# EAGLE design hv (EAGLE 5.06)
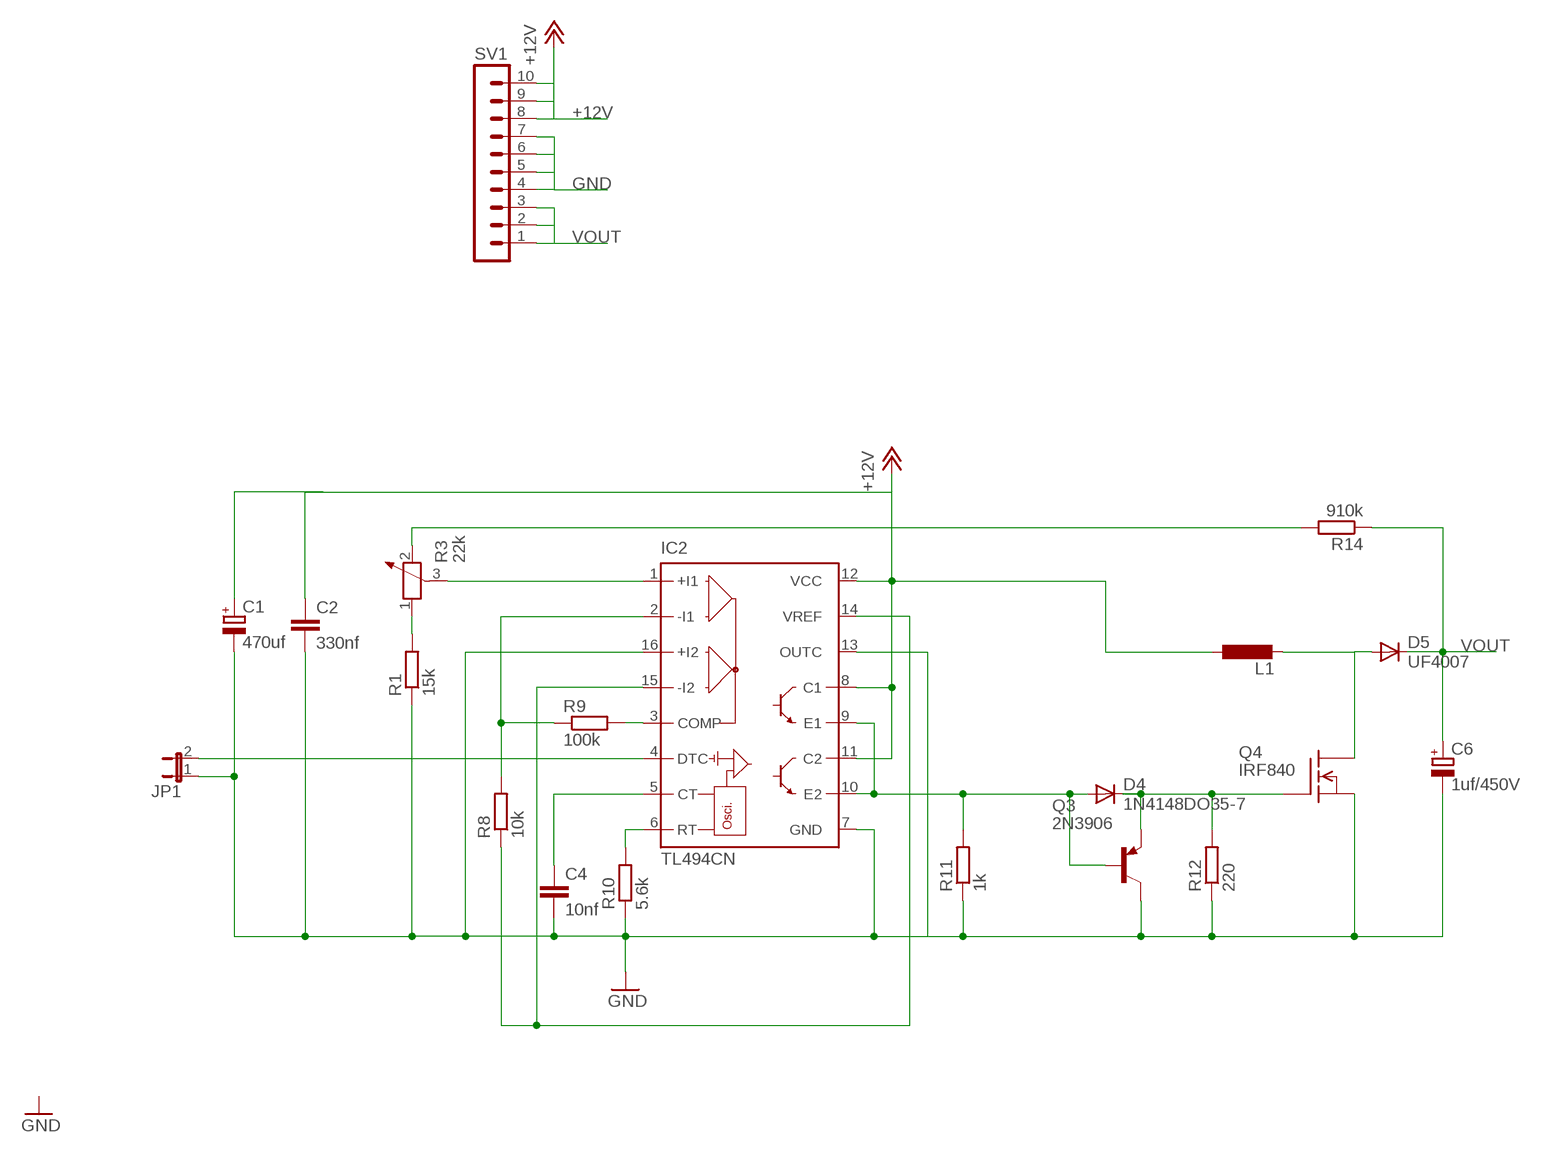
[diagram p0: schematic, sheet 1]

## Parts
C1  470uf  CPOL-EUSANYO_E13  [SANYO-OSCON_E13]
C2  330nf  C-EU025_050-025X075  [C025_050-025X075]
C4  10nf  C-EU025_050-025X075  [C025_050-025X075]
C6  1uf/450V  CPOL-EUSANYO_E13  [SANYO-OSCON_E13]
D4  1N4148DO35-7  [DO35-7]
D5  UF4007  UF4003  [DO41-10]
IC2  TL494CN  [DIL16]
JP1  JP1E  [JP1]
L1  L-EUIR-4  [IR-4]
Q3  2N3906  [TO92]
Q4  IRF840  [TO220]
R1  15k  R-EU_0204/7  [0204/7]
R3  22k  POTENTIOMETER_PT-10  [PT-10]
R8  10k  R-EU_0204/7  [0204/7]
R9  100k  R-EU_0204/7  [0204/7]
R10  5.6k  R-EU_0204/7  [0204/7]
R11  1k  R-EU_0204/7  [0204/7]
R12  220  R-EU_0204/7  [0204/7]
R14  910k  R-EU_0204/7  [0204/7]
SV1  MA10-1W  [MA10-1W]

## Nets
+12V: C1.+ C2.1 IC2.8(C1) IC2.11(C2) IC2.12(VCC) L1.1 SV1.8 SV1.9 SV1.10
GND: C1.- C2.2 C4.2 C6.- IC2.7(GND) IC2.13(OUTC) IC2.16(+I2) JP1.1 Q3.1(C) Q4.3(S) R1.1 R10.1 R11.1 R12.1 SV1.4 SV1.5 SV1.6 SV1.7
N$1: IC2.4(DTC) JP1.2
N$2: D4.C Q3.3(E) Q4.1(G) R12.2
N$3: IC2.3(COMP) R9.2
N$4: IC2.2(-I1) R8.2 R9.1
N$6: IC2.1(+I1) R3.3
N$7: R1.2 R3.1
N$8: D4.A IC2.9(E1) IC2.10(E2) Q3.2(B) R11.2
N$9: IC2.6(RT) R10.2
N$10: C4.1 IC2.5(CT)
N$11: D5.A L1.2 Q4.2(D)
N$13: R3.2 R14.2
VOUT: C6.+ D5.C R14.1 SV1.1 SV1.2 SV1.3
VREF: IC2.14(VREF) IC2.15(-I2) R8.1

## Library data of the parts
C1 C6 = rcl:CPOL-EU: POLARIZED CAPACITOR, European symbol
C2 C4 = rcl:C-EU: CAPACITOR, European symbol
D4 = diode:1N4148: DIODE high speed (Philips)
D5 = diode:UF4003: DIODE ultrafast recovery diode, 200 V rectifier
IC2 = linear:TL494*: SWITCHMODE Pulse Width Modulation Control Circuit NCV494B http://onsemi.com tl494-d.pdf
JP1 = jumper:JP1E: JUMPER
L1 = rcl:L-EU: INDUCTOR, European symbol
Q3 = transistor-pnp:2N3906: PNP Transistor
Q4 = transistor-fet:IRF840: N-Channel Enhancement MOSFET (HEXFET); 500V; 8A; 0,85Ohm
R1 R8-R12 R14 = rcl:R-EU_: RESISTOR, European symbol
R3 = rcl:POTENTIOMETER_: Potentiometer
SV1 = con-lstb:MA10-1W: PIN HEADER

## Board
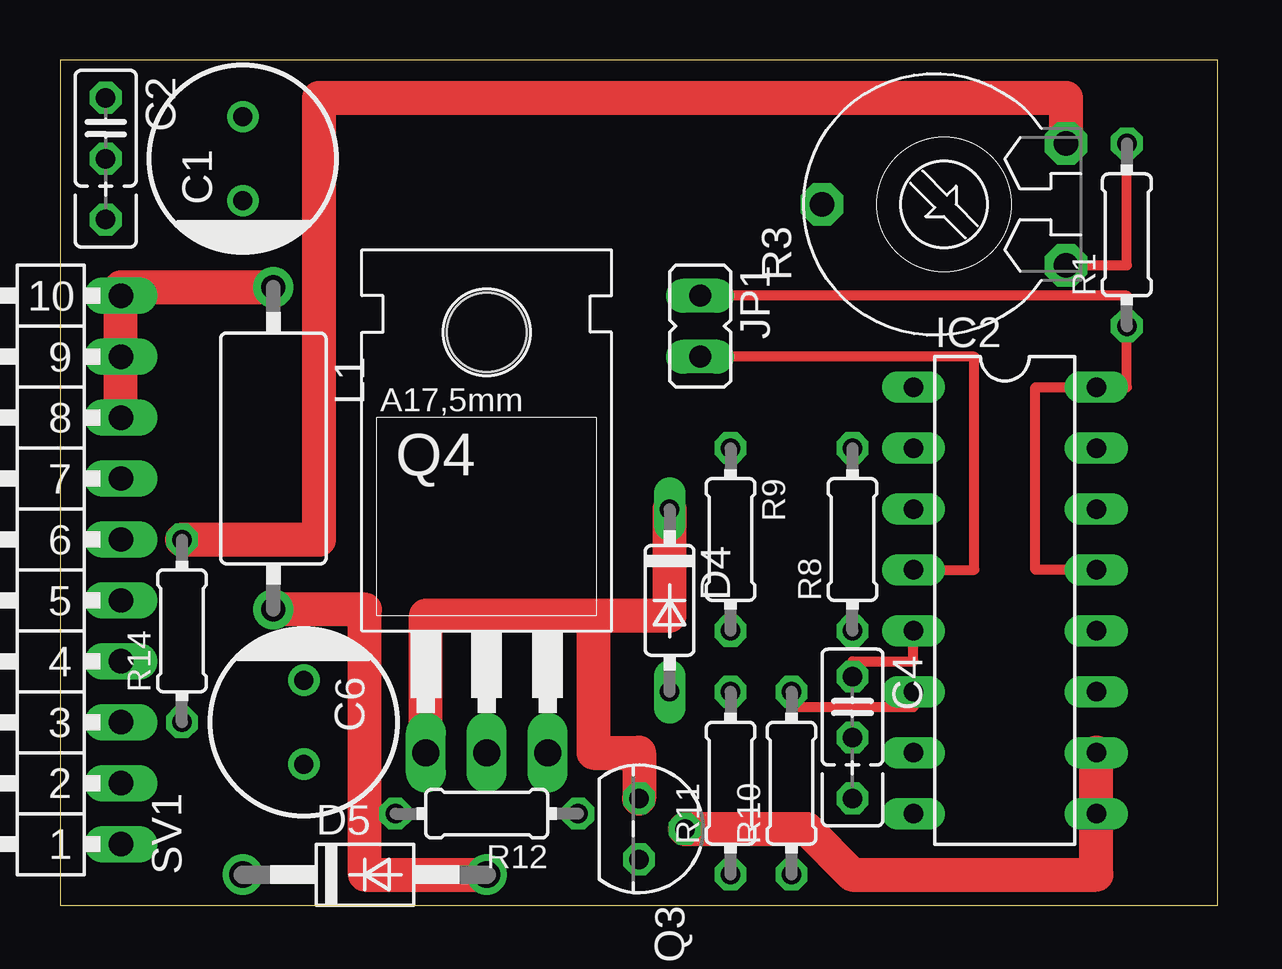
[diagram p1: board, top side]
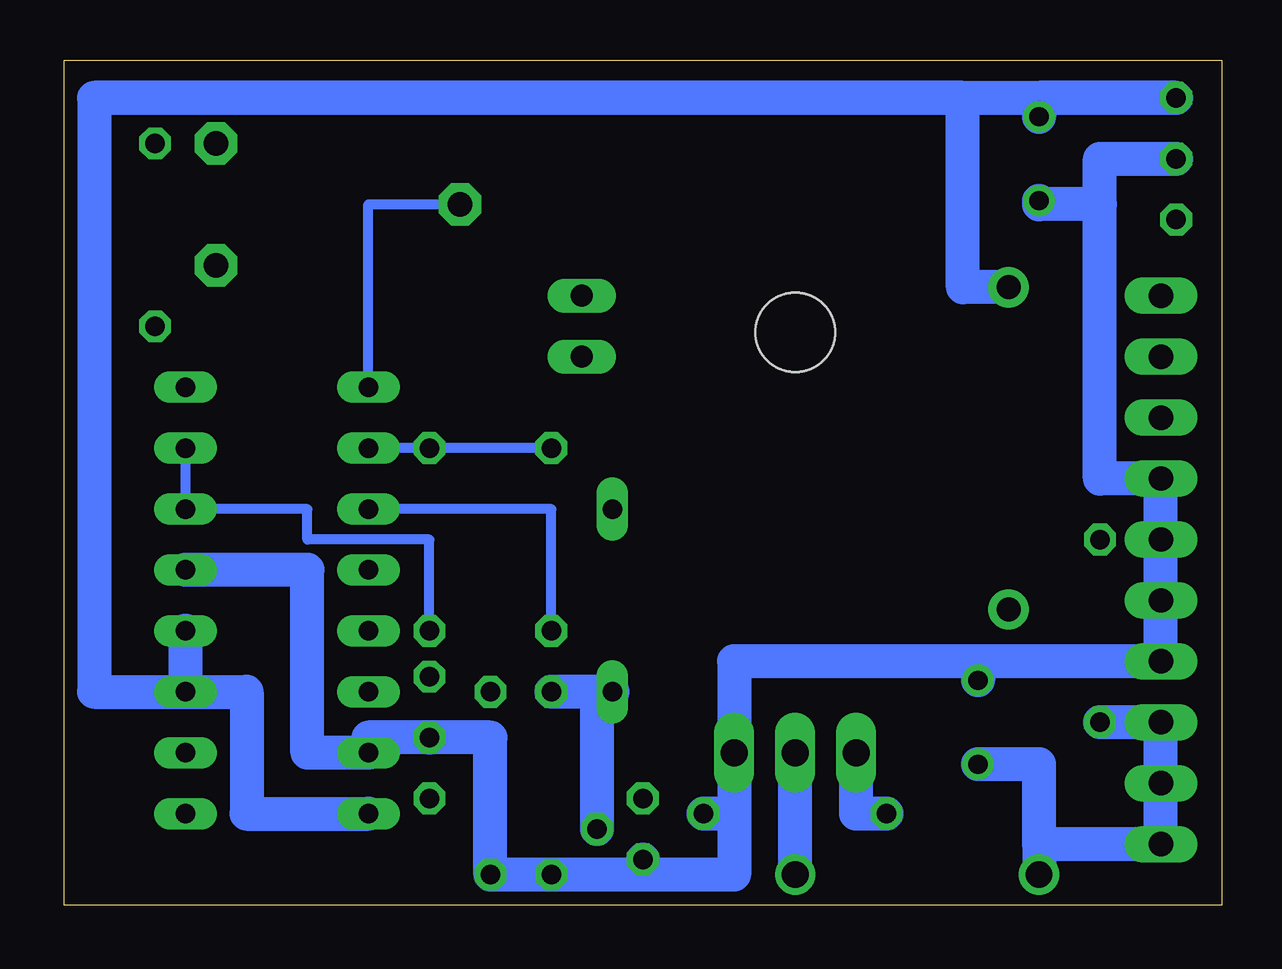
[diagram p2: board, bottom side, seen from below]

Size 48.24 x 35.23 mm. Coordinates in mm from the lower left corner, seen from the top.
Outline: 0,0 48.24,0 48.24,35.23 0,35.23 0,0
Copper layers (1*16): Top 0.035mm / dielectric 1.5mm / Bottom 0.035mm
Design rules "default": minimum track width 10mil, minimum drill 24mil, track to track 8mil, track to pad 8mil, pad to pad 8mil, via to via 8mil, smd to smd 8mil, copper to edge 40mil, drill to drill 8mil, minimum pad ring 10mil, minimum via ring 8mil, stop-mask expansion 4mil, vias tented up to drill 0mil, thermal gap 10mil

### Footprints (pad centres in the part's own frame; a part is rotated, then mirrored left to right if it is on the bottom)
SANYO-OSCON_E13 = drill 0.8 pad 1.27 round: + 1.75,0; - -1.75,0
C025_050-025X075 = drill 0.813 octagon: 1 -1.27,0; 2 1.27,0; 3 3.81,0
DO35-7 = drill 0.813 long: A 3.81,0; C -3.81,0
DO41-10 = drill 1.118 round: A 5.08,0; C -5.08,0
DIL16 = drill 0.813 long: 1 -8.89,-3.81; 2 -6.35,-3.81; 3 -3.81,-3.81; 4 -1.27,-3.81; 5 1.27,-3.81; 6 3.81,-3.81; 7 6.35,-3.81; 8 8.89,-3.81; 9 8.89,3.81; 10 6.35,3.81; 11 3.81,3.81; 12 1.27,3.81; 13 -1.27,3.81; 14 -3.81,3.81; 15 -6.35,3.81; 16 -8.89,3.81
JP1 = drill 0.914 long: 1 0,-1.27; 2 0,1.27
IR-4 = drill 1 pad 1.676 round: 1 -6.705,0; 2 6.73,0
TO92 = drill 0.813 octagon: 1 1.27,0; 2 0,1.905; 3 -1.27,0
TO220 = drill 1.118 long: 1 -2.54,-6.35; 2 0,-6.35; 3 2.54,-6.35 | hole 3.302: 0,11.176
0204/7 = drill 0.813 octagon: 1 -3.81,0; 2 3.81,0
PT-10 = drill 1.016 pad 1.778 octagon: 1 -2.54,-5.08; 2 2.54,-5.08; 3 0,5.08
MA10-1W = drill 1.016 long: 1 -11.43,0; 2 -8.89,0; 3 -6.35,0; 4 -3.81,0; 5 -1.27,0; 6 1.27,0; 7 3.81,0; 8 6.35,0; 9 8.89,0; 10 11.43,0

### Placement (x,y rotation side)
C1  7.62,31.11 90 top
C2  1.91,32.38 270 top
C4  33.02,8.26 270 top
C6  10.16,7.62 270 top
D4  25.4,12.7 270 top
D5  12.7,1.27 0 top
IC2  39.37,12.7 270 top
JP1  26.67,24.13 180 top
L1  8.89,19.05 270 top
Q3  24.13,3.17 270 top
Q4  17.78,12.7 0 top
R1  44.45,27.94 90 top
R3  36.83,29.21 90 top
R8  33.02,15.24 90 top
R9  27.94,15.24 270 top
R10  30.48,5.08 90 top
R11  27.94,5.08 90 top
R12  17.78,3.81 180 top
R14  5.08,11.43 90 top
SV1  2.54,13.97 90 top

### Tracks (layer width: path | path; a pad name or v marks a point on that pad's centre or on a via)
+12V
  Top 1.422: SV1.8 SV1.9 SV1.10 2.54,25.75 L1.1
  Bottom 1.422: IC2.8 40.64,3.81 40.64,8.89 IC2.11 | IC2.11 IC2.12 | 46.99,33.66 46.99,8.89 IC2.11 | C1.+ 7.62,33.66 C2.1 46.99,33.66 | 46.99,33.66 10.79,33.66 10.79,25.75 L1.1
GND
  Top 0.406: JP1.1 44.45,25.4 R1.1 44.45,21.59 IC2.16 40.64,21.59 40.64,13.97 IC2.13
  Bottom 1.422: 10.16,10.16 C6.- | 10.16,10.16 SV1.4 SV1.5 SV1.6 SV1.7 5.08,17.78 5.08,29.21 | 20.32,3.81 Q4.3 20.32,10.16 10.16,10.16 | 20.32,3.81 R12.1 | 20.32,3.81 20.32,1.27 24.13,1.27 | IC2.13 38.1,13.97 38.1,6.35 IC2.7 35.56,6.99 C4.2 30.48,6.99 R10.1 R11.1 24.13,1.27 | 24.13,1.27 Q3.1 | 5.08,29.21 7.62,29.21 C1.- | C2.2 5.08,31.11 5.08,29.21
N$1
  Top 0.406: JP1.2 38.1,22.86 38.1,13.97 IC2.4
N$2
  Top 1.422: Q4.1 15.24,12.06 22.23,12.06 | Q3.3 24.13,6.35 22.23,6.35 22.23,12.06 | D4.C 25.4,12.06 22.23,12.06
  Bottom 1.422: R12.2 15.24,3.81 Q4.1
N$3
  Bottom 0.406: IC2.3 27.94,16.51 R9.2
N$4
  Bottom 0.406: IC2.2 R8.2 R9.1
N$6
  Bottom 0.406: R3.3 35.56,29.21 IC2.1
N$7
  Top 0.406: R3.1 44.45,26.67 R1.2
N$8
  Top 1.422: Q3.2 31.11,3.17 33.02,1.27 43.18,1.27 IC2.9 IC2.10
  Bottom 1.422: 26.04,8.89 D4.A | 26.04,8.89 R11.2 | Q3.2 26.04,8.89
N$9
  Top 0.406: R10.2 30.48,8.26 35.56,8.26 IC2.6
N$10
  Top 0.406: C4.1 33.02,10.16 35.56,10.16 IC2.5
N$11
  Top 1.422: L1.2 12.7,12.32 12.7,1.27 D5.A
  Bottom 1.422: D5.A Q4.2
N$13
  Top 1.422: R14.2 10.79,15.24 10.79,33.66 41.91,33.66 R3.2
VOUT
  Bottom 1.422: 7.62,2.54 SV1.1 SV1.2 SV1.3 R14.1 | 7.62,2.54 D5.C | C6.+ 7.62,5.87 7.62,2.54
VREF
  Bottom 0.406: IC2.15 IC2.14 38.1,16.51 38.1,15.24 33.02,15.24 R8.1